# Altium schematic sheet RS485_CAN.SchDoc
size A
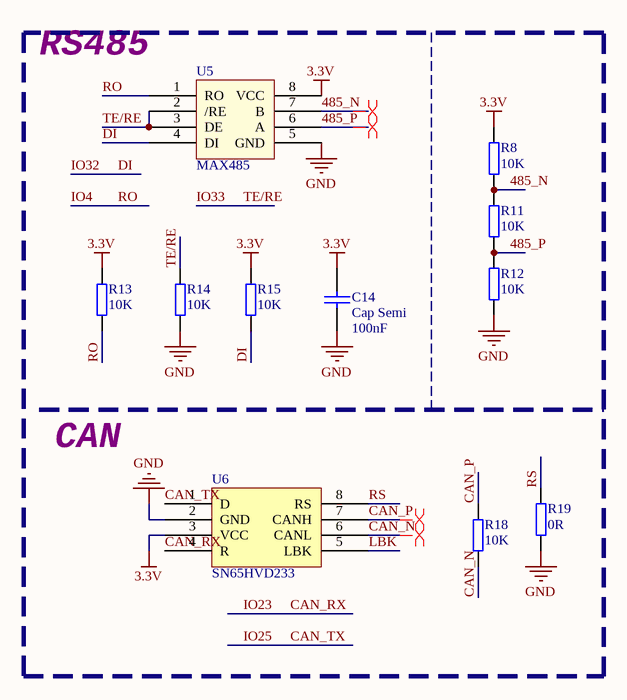
[diagram p0: RS485_CAN.SchDoc]

## Parts
C14  Cap Semi  value 100nF  [SMT0603]
R8  value 10K  [SMT0603]  (hidden comment: Resistor)
R11  value 10K  [SMT0603]  (hidden comment: Resistor)
R12  value 10K  [SMT0603]  (hidden comment: Resistor)
R13  value 10K  [SMT0603]  (hidden comment: Resistor)
R14  value 10K  [SMT0603]  (hidden comment: Resistor)
R15  value 10K  [SMT0603]  (hidden comment: Resistor)
R18  value 10K  [SMT0603]  (hidden comment: Resistor)
R19  value 0R  [SMT0603]  (hidden comment: Resistor)
U5  MAX485  [SOP8]
U6  SN65HVD233  [PCBComponent_1]

## Nets
3.3V: C14.2 R8.2 R13.2 R15.2 U5.8(VCC) U6.3(VCC)
GND: C14.1 R12.1 R14.1 R19.1 U5.5(GND) U6.2(GND)
485_N: R8.1 R11.2 U5.7(B)
485_P: R11.1 R12.2 U5.6(A)
CAN_N: R18.1 U6.6(CANL)
CAN_P: R18.2 U6.7(CANH)
CAN_RX: U6.4(R)  [also labelled IO23]
CAN_TX: U6.1(D)  [also labelled IO25]
DI: R15.1 U5.4(DI)  [also labelled IO32]
IO4: R13.1 U5.1(RO)  [also labelled RO]
IO33: R14.2 U5.2(/RE) U5.3(DE)  [also labelled TE/RE]
LBK: U6.5(LBK)
RS: R19.2 U6.8(RS)

## Layout directives
differential pair: 485_N, 485_P, CAN_N, CAN_P

## Notes on the sheet
- RS485
- CAN

## Library data of the parts
C14 = CAP-SM-0603-X7R-100nF: CAP SM 0603 X7R 100nF 10%; Tolerance: ±10%; Supplier 1: Digi-Key; Supplier 2: Farnell; Supplier Part Number 1: 490-3167-1-ND; Supplier Part Number 2: 1775994RL
R8 R11-R15 R18 R19 = RES-SM-0603-10K: RES SM 0603 10K; Supplier 1: Farnell; Supplier 2: Digi-Key; Supplier Part Number 1: 9330399; Supplier Part Number 2: 541-10.0KHCT-ND